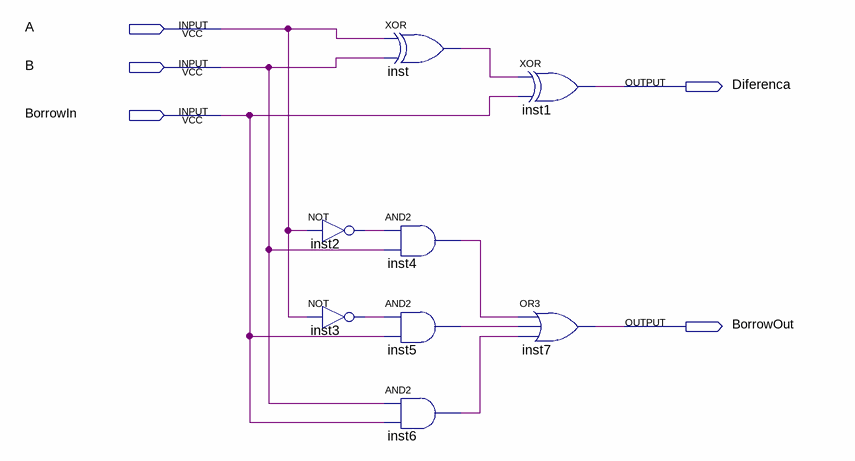
[diagram p0: schematic sheet]
// Quartus schematic CelulaSubtrator.bdf as structural Verilog: 8 symbols, 5 pins
module CelulaSubtrator (
  input  A,
  input  B,
  input  BorrowIn,
  output Diferenca,
  output BorrowOut
);

  wire inst2_out, inst3_out, inst4_out, inst5_out, inst6_out, inst_out;

  not inst2 (inst2_out, A);
  not inst3 (inst3_out, A);
  xor inst (inst_out, A, B);
  and inst4 (inst4_out, inst2_out, B);
  and inst5 (inst5_out, inst3_out, BorrowIn);
  and inst6 (inst6_out, B, BorrowIn);
  xor inst1 (Diferenca, inst_out, BorrowIn);
  or inst7 (BorrowOut, inst4_out, inst5_out, inst6_out);
endmodule
